# Altium schematic sheet POWER IN 12V2A.SchDoc
size A4
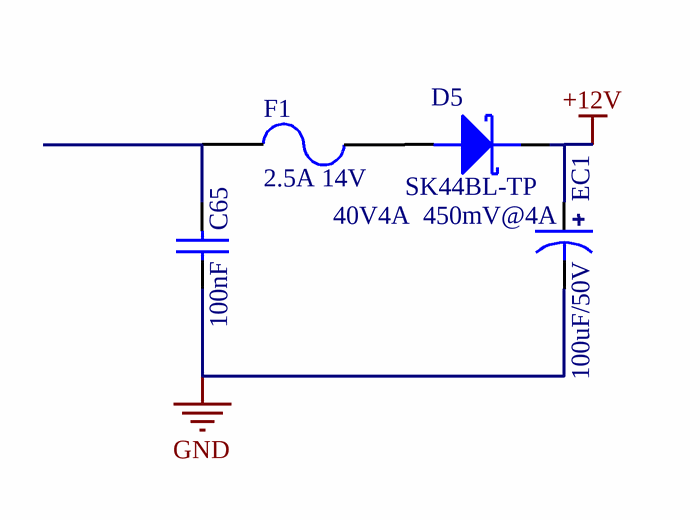
[diagram p0: POWER IN 12V2A.SchDoc]

## Parts
C65  100nF  [C_0603]
D5  40V4A  450mV@4A  Manufacturer_Part_Number: SK44BL-TP  [SMB_DO214AA]
EC1  100uF/50V  [SMD-D6.3XL7.7]
F1  2.5A 14V  [Fuse_1812]

## Nets
+12V: D5.K EC1.1
GND: C65.2 EC1.2
NetC65_1: C65.1 F1.1
NetD5_A: D5.A F1.2

## Library data of the parts
C65 = Cap_Chip: 贴片电容; Manufacturer_Name: *; Manufacturer_Part_Number: *
D5 = Diode_Schottky: 肖特基二极管; Manufacturer_Name: MCC(美微科); LCSC: C151740
EC1 = Cap_E_SMD: 贴片电解电容; Manufacturer_Name: Nichicon(尼吉康); Manufacturer_Part_Number: RX100UF50V90RV0105; LCSC: C3445238
F1 = FUSE_PTC: 自恢复贴片保险丝; Manufacturer_Name: TLC-MSMD250/14; Manufacturer_Part_Number: C381482